# Altium project spider-nest.PrjPcb
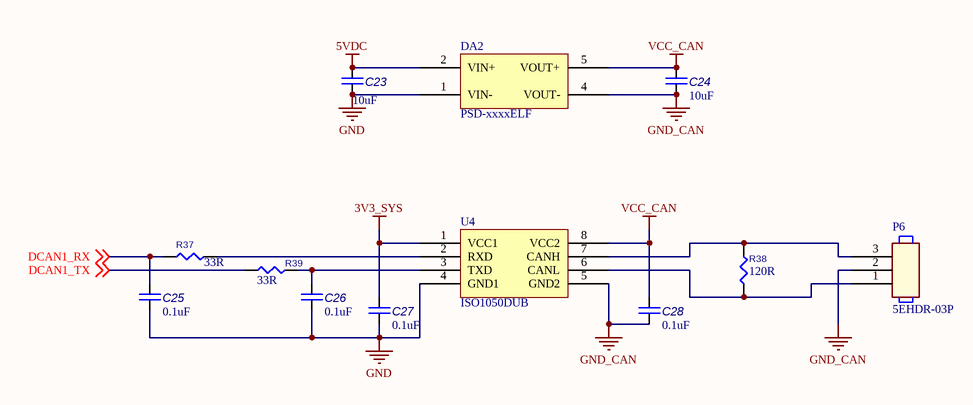
[diagram p0: can.SchDoc]
12 sheets, 181 parts. Net scope: flat (ports and power ports of the same name join across sheets).
Board file: spider-nest.PcbDoc
Sheets:
  can.SchDoc
  wifi.SchDoc
  audio.SchDoc
  spider-som.SchDoc
  eth_usb.SchDoc
  power.SchDoc
  rs485.SchDoc
  digital-in.SchDoc
  relay.SchDoc
  1-wire.SchDoc
  boot.SchDoc
  expansion_gpio.SchDoc

## Sheet can.SchDoc
size A4

### Parts
C23  value 10uF  [CC2012-0805]  (hidden comment: C0805)
C24  value 10uF  [CC2012-0805]  (hidden comment: C0805)
C25  value 0.1uF  [CC1608-0603]  (hidden comment: C0603)
C26  value 0.1uF  [CC1608-0603]  (hidden comment: C0603)
C27  value 0.1uF  [CC1608-0603]  (hidden comment: C0603)
C28  value 0.1uF  [CC1608-0603]  (hidden comment: C0603)
DA2  PSD-xxxxELF  [PSD-xxxxELF]
P6  P/N: 5EHDR-03P  [TE_282814-3]  (hidden comment: TE_282814-3)
R37  value 33R  [RESC1608X55N]  (hidden comment: R0603)
R38  value 120R  [RESC1608X55N]  (hidden comment: R0603)
R39  value 33R  [RESC1608X55N]  (hidden comment: R0603)
U4  ISO1050DUB  [SO-G8/Z10.8]

### Nets
3V3_SYS: C27.1 U4.1(VCC1)
5VDC: C23.2 DA2.2(VIN+)
GND: C23.1 C25.2 C26.2 C27.2 DA2.1(VIN-) U4.4(GND1)
GND_CAN: C24.1 C28.2 DA2.4(VOUT-) P6.2 U4.5(GND2)
VCC_CAN: C24.2 C28.1 DA2.5(VOUT+) U4.8(VCC2)
DCAN1_RX: C25.1 R37.2 ; off-sheet DCAN1_RX
DCAN1_TX: R39.2 ; off-sheet DCAN1_TX
NetC26_1: C26.1 R39.1 U4.3(TXD)
NetP6_1: P6.1 R38.1 U4.6(CANL)
NetP6_3: P6.3 R38.2 U4.7(CANH)
NetR37_1: R37.1 U4.2(RXD)

### Library data of the parts
DA2 = PSD-xxxxELF: single output isolated DC/DC converter; Manufacturer: PEAK electronics; P/N: PSD-0505ELF
P6 = TE_282814-3: Terminal Block Connectors
U4 = ISO1050DUB: ISOLATED CAN TRANSCEIVER; Manufacturer: TI; P/N: ISO1050DUBR
C23 C24 = C0805: P/N: *
C25-C28 = C0603: P/N: *
R37-R39 = R0603: P/N: *

## Sheet wifi.SchDoc
size A4
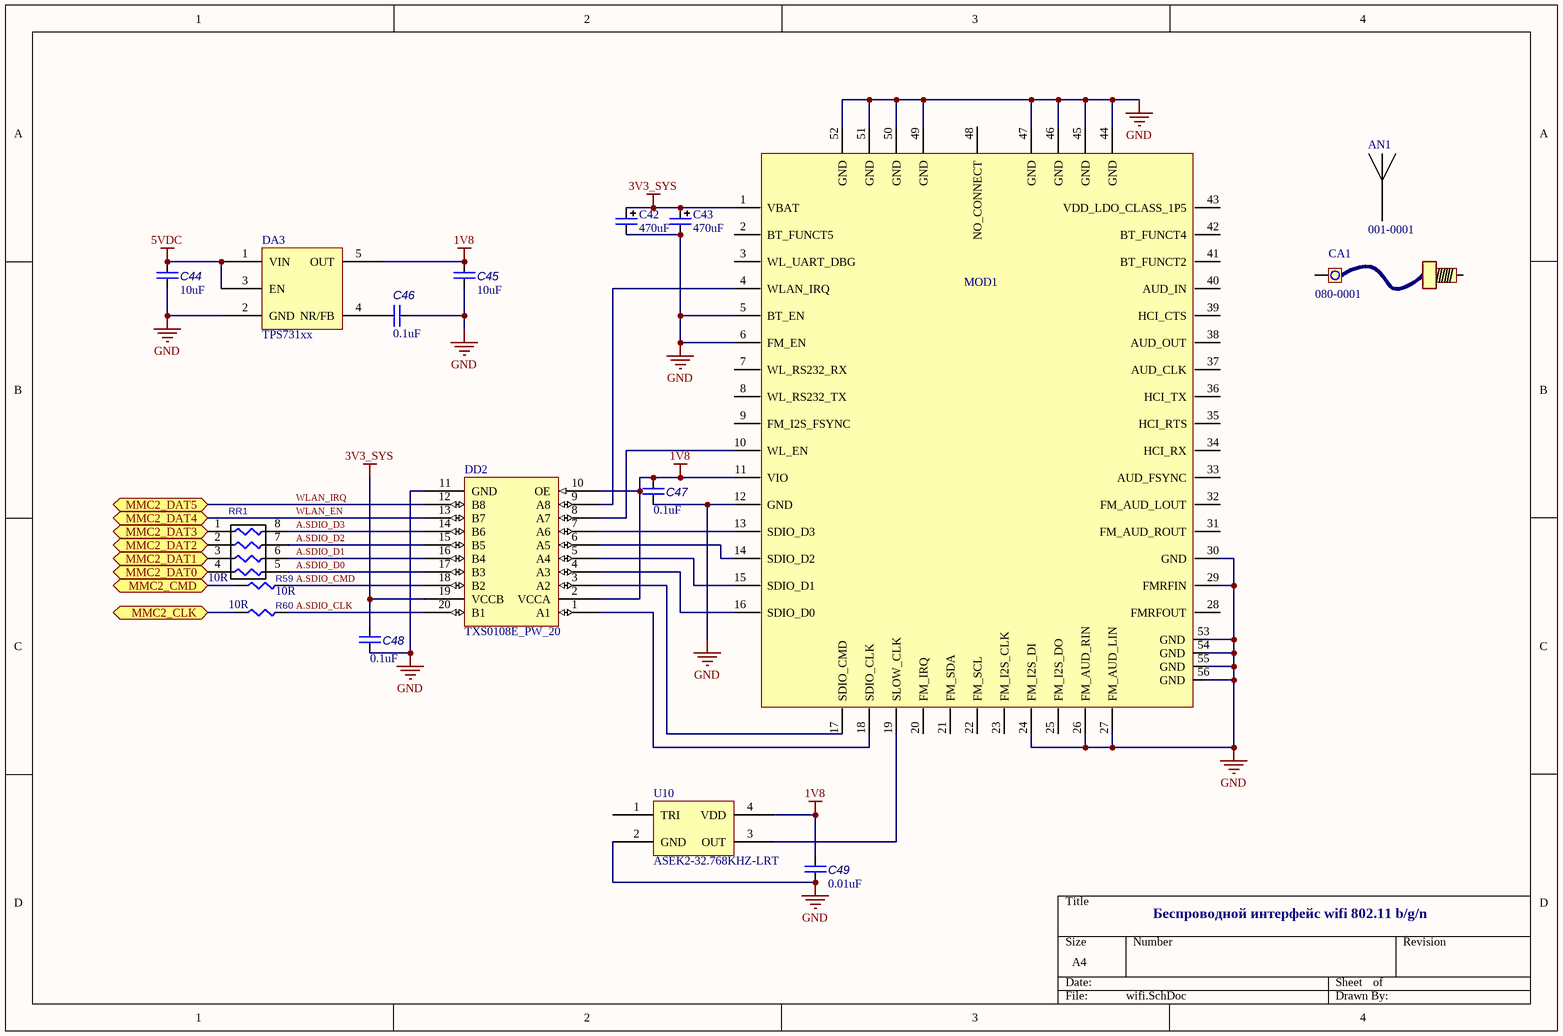
[diagram p1: wifi.SchDoc]

### Parts
AN1  P/N: 001-0001  (hidden comment: Antenna)
C42  value 470uF  [Cap_D]  (hidden comment: Cap_D)
C43  value 470uF  [Cap_D]  (hidden comment: Cap_D)
C44  value 10uF  [CC2012-0805]  (hidden comment: C0805)
C45  value 10uF  [CC2012-0805]  (hidden comment: C0805)
C46  value 0.1uF  [CC1608-0603]  (hidden comment: C0603)
C47  value 0.1uF  [CC1608-0603]  (hidden comment: C0603)
C48  value 0.1uF  [CC1608-0603]  (hidden comment: C0603)
C49  value 0.01uF  [CC1608-0603]  (hidden comment: C0603)
CA1  P/N: 080-0001  (hidden comment: Cable)
DA3  TPS731xx  [SOT95P280X145-5N]
DD2  TXS0108E_PW_20  [PW20]
MOD1  TIWI-R2_MODULE_UFL  [tiwi-r2]  (value not drawn)
R59  value 10R  [RESC1608X55N]  (hidden comment: R0603)
R60  value 10R  [RESC1608X55N]  (hidden comment: R0603)
RR1  value 10R  [CAY16-J4]  (hidden comment: CAY-J4)
U10  ASEK2-32.768KHZ-LRT  [asek1]

### Ports
MMC2_CLK, MMC2_CMD, MMC2_DAT0, MMC2_DAT1, MMC2_DAT2, MMC2_DAT3, MMC2_DAT4, MMC2_DAT5

### Nets
1V8: C45.2 C47.2 C49.1 DA3.5(OUT) DD2.2(VCCA) DD2.10(OE) MOD1.11(VIO) U10.4(VDD)
3V3_SYS: C42.1 C43.1 C48.2 DD2.19(VCCB) MOD1.1(VBAT)
5VDC: C44.2 DA3.1(VIN) DA3.3(EN)
GND: C42.2 C43.2 C44.1 C45.1 C46.1 C47.1 C48.1 C49.2 DA3.2(GND) DD2.11(GND) MOD1.5(BT_EN) MOD1.6(FM_EN) MOD1.12(GND) MOD1.24(FM_I2S_DI) MOD1.26(FM_AUD_RIN) MOD1.27(FM_AUD_LIN) MOD1.29(FMRFIN) MOD1.30(GND) MOD1.44(GND) MOD1.45(GND) MOD1.46(GND) MOD1.47(GND) MOD1.49(GND) MOD1.50(GND) MOD1.51(GND) MOD1.52(GND) MOD1.53(GND) MOD1.54(GND) MOD1.55(GND) MOD1.56(GND) U10.2(GND)
A.SDIO_CLK: DD2.20(B1) R60.2
A.SDIO_CMD: DD2.18(B2) R59.2
A.SDIO_D0: DD2.17(B3) RR1.5
A.SDIO_D1: DD2.16(B4) RR1.6
A.SDIO_D2: DD2.15(B5) RR1.7
A.SDIO_D3: DD2.14(B6) RR1.8
WLAN_EN: DD2.13(B7) ; port MMC2_DAT4
WLAN_IRQ: DD2.12(B8) ; port MMC2_DAT5
NetC46_2: C46.2 DA3.4(NR/FB)
NetDD2_1: DD2.1(A1) MOD1.18(SDIO_CLK)
NetDD2_3: DD2.3(A2) MOD1.17(SDIO_CMD)
NetDD2_4: DD2.4(A3) MOD1.16(SDIO_D0)
NetDD2_5: DD2.5(A4) MOD1.15(SDIO_D1)
NetDD2_6: DD2.6(A5) MOD1.14(SDIO_D2)
NetDD2_7: DD2.7(A6) MOD1.13(SDIO_D3)
NetDD2_8: DD2.8(A7) MOD1.10(WL_EN)
NetDD2_9: DD2.9(A8) MOD1.4(WLAN_IRQ)
NetMOD1_19: MOD1.19(SLOW_CLK) U10.3(OUT)
NetR59_1: R59.1 ; port MMC2_CMD
NetR60_1: R60.1 ; port MMC2_CLK
NetRR1_1: RR1.1 ; port MMC2_DAT3
NetRR1_2: RR1.2 ; port MMC2_DAT2
NetRR1_3: RR1.3 ; port MMC2_DAT1
NetRR1_4: RR1.4 ; port MMC2_DAT0

Not connected (* = marked no-connect by the designer): AN1 1; CA1 1 2; MOD1 2(BT_FUNCT5) 3(WL_UART_DBG) 7(WL_RS232_RX) 8(WL_RS232_TX) 9(FM_I2S_FSYNC) 20(FM_IRQ) 21(FM_SDA) 22(FM_SCL) 23(FM_I2S_CLK) 25(FM_I2S_DO) 28(FMRFOUT) 31(FM_AUD_ROUT) 32(FM_AUD_LOUT) 33(AUD_FSYNC) 34(HCI_RX) 35(HCI_RTS) 36(HCI_TX) 37(AUD_CLK) 38(AUD_OUT) 39(HCI_CTS) 40(AUD_IN) 41(BT_FUNCT2) 42(BT_FUNCT4) 43(VDD_LDO_CLASS_1P5) 48(NO_CONNECT); U10 1(TRI)

### Notes on the sheet
- Беспроводной интерфейс wifi 802.11 b/g/n

### Library data of the parts
C42 C43 = Cap_D: Tantalum Capacitor Case D; P/N: TR3D477M6R3C0200
CA1 = Cable: Wifi Cable
DA3 = TPS731xx: Cap-Free, NMOS, 150mA LDO; Manufacturer: TI; P/N: TPS73118DBVT
DD2 = TXS0108E_PW_20: Imported; Vendor: Texas Instruments; P/N: TXS0108EPWR; PACKAGE_DESIGNATOR: PW; PIN_COUNT: 20; FAMILY_NAME: AUTO DIRECTION SENSING DUAL SUPPLY TRANSLATOR; INDUSTRY_STD_PKG_TYPE: TSSOP; Manufacturer_Part_Number: txs0108e_pw_20; Datasheet URL: http://www.ti.com/lit/gpn/TXS0108E; Manufacturer: Texas Instruments; RefDes: RefDes; Type: DEV; Value: Value
MOD1 = TIWI-R2_MODULE_UFL: TiWi-R2 with u.fl Module; MANUFACTURER: LSR; Geometry.Height: 1.9mm; P/N: 450-0037; PCB DECAL: TIWI-R2_UFL
RR1 = CAY-J4: Resistor network 4x
U10 = ASEK2-32.768KHZ-LRT: 32.768KHZ 1.8V oscillator; Manufacturer: Abracon; P/N: ASEK2-32.768KHZ-LRT
C44 C45 = C0805: P/N: *
C46-C49 = C0603: P/N: *
R59 R60 = R0603: P/N: *

## Sheet audio.SchDoc
size A4
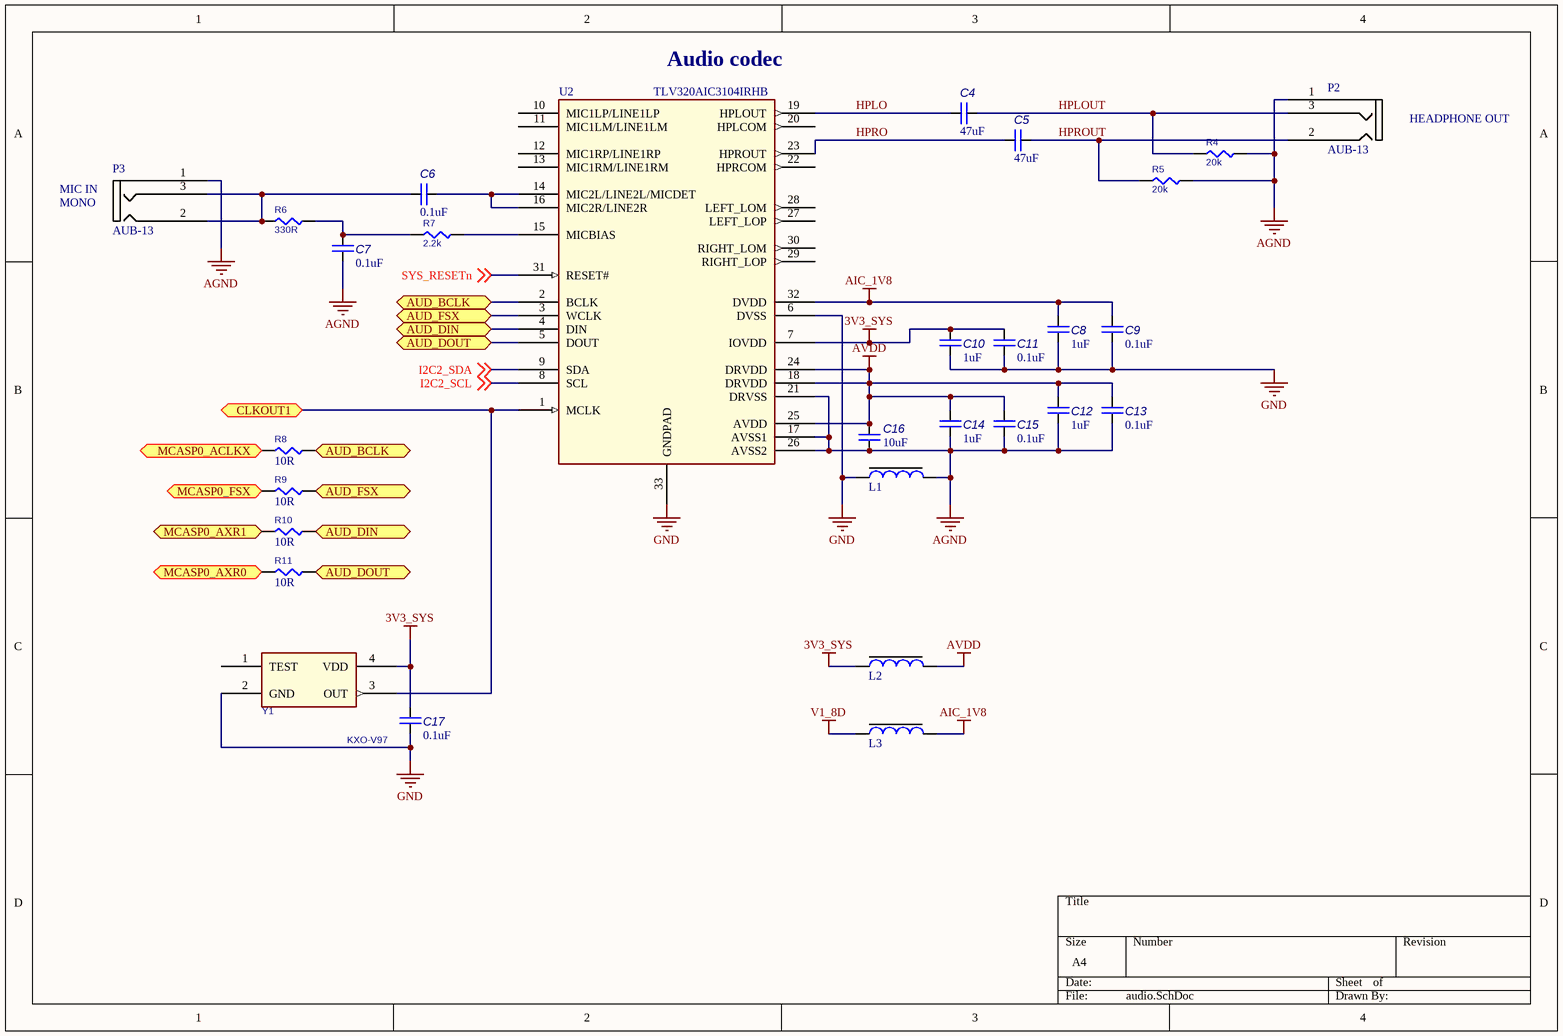
[diagram p2: audio.SchDoc]

### Parts
C4  value 47uF  [CC3216-1206]  (hidden comment: C1206)
C5  value 47uF  [CC3216-1206]  (hidden comment: C1206)
C6  value 0.1uF  [CC1608-0603]  (hidden comment: C0603)
C7  value 0.1uF  [CC1608-0603]  (hidden comment: C0603)
C8  value 1uF  [CC1608-0603]  (hidden comment: C0603)
C9  value 0.1uF  [CC1608-0603]  (hidden comment: C0603)
C10  value 1uF  [CC1608-0603]  (hidden comment: C0603)
C11  value 0.1uF  [CC1608-0603]  (hidden comment: C0603)
C12  value 1uF  [CC1608-0603]  (hidden comment: C0603)
C13  value 0.1uF  [CC1608-0603]  (hidden comment: C0603)
C14  value 1uF  [CC1608-0603]  (hidden comment: C0603)
C15  value 0.1uF  [CC1608-0603]  (hidden comment: C0603)
C16  value 10uF  [CC2012-0805]  (hidden comment: C0805)
C17  value 0.1uF  [CC1608-0603]  (hidden comment: C0603)
L1  BLM21  [CC2012-0805]  (value not drawn)
L2  BLM21  [CC2012-0805]  (value not drawn)
L3  BLM21  [CC2012-0805]  (value not drawn)
P2  AUB-13  [AUB_13]
P3  AUB-13  [AUB_13]
R4  value 20k  [CHIP0603]  (hidden comment: R0603)
R5  value 20k  [CHIP0603]  (hidden comment: R0603)
R6  value 330R  [CHIP0603]  (hidden comment: R0603)
R7  value 2.2k  [CHIP0603]  (hidden comment: R0603)
R8  value 10R  [RESC1608X55N]  (hidden comment: R0603)
R9  value 10R  [RESC1608X55N]  (hidden comment: R0603)
R10  value 10R  [RESC1608X55N]  (hidden comment: R0603)
R11  value 10R  [RESC1608X55N]  (hidden comment: R0603)
U2  Man P/N: TLV320AIC3104IRHB  [QFN5X5-32]  (hidden comment: TLV320AIC3104)
Y1  KXO-V97  [KXO_V97]

### Ports
AUD_BCLK, AUD_DIN, AUD_DOUT, AUD_FSX, CLKOUT1, MCASP0_ACLKX, MCASP0_AXR0, MCASP0_AXR1, MCASP0_FSX

### Nets
3V3_SYS: C10.1 C11.1 C17.1 L2.1 U2.7(IOVDD) Y1.4(VDD)
AGND: C7.1 C12.2 C13.2 C14.2 C15.2 C16.1 L1.2 P2.1(GND) P3.1(GND) R4.1 R5.1 U2.17(AVSS1) U2.21(DRVSS) U2.26(AVSS2)
AIC_1V8: C8.1 C9.1 L3.2 U2.32(DVDD)
AVDD: C12.1 C13.1 C14.1 C15.1 C16.2 L2.2 U2.18(DRVDD) U2.24(DRVDD) U2.25(AVDD)
GND: C8.2 C9.2 C10.2 C11.2 C17.2 L1.1 U2.6(DVSS) U2.33(GNDPAD) Y1.2(GND)
V1_8D: L3.1
HPLO: C4.2 U2.19(HPLOUT)
HPLOUT: C4.1 P2.3(LEFT) R4.2
HPRO: C5.2 U2.23(HPROUT)
HPROUT: C5.1 P2.2(RIGHT) R5.2
I2C2_SCL: U2.8(SCL) ; off-sheet I2C2_SCL
I2C2_SDA: U2.9(SDA) ; off-sheet I2C2_SDA
SYS_RESETn: U2.31(RESET#) ; off-sheet SYS_RESETn
NetC6_1: C6.1 P3.2(RIGHT) P3.3(LEFT) R6.1
NetC6_2: C6.2 U2.14(MIC2L/LINE2L/MICDET) U2.16(MIC2R/LINE2R)
NetC7_2: C7.2 R6.2 R7.1
NetR7_2: R7.2 U2.15(MICBIAS)
NetR8_1: R8.1 ; port MCASP0_ACLKX
NetR8_2: R8.2 U2.2(BCLK) ; port AUD_BCLK
NetR9_1: R9.1 ; port MCASP0_FSX
NetR9_2: R9.2 U2.3(WCLK) ; port AUD_FSX
NetR10_1: R10.1 ; port MCASP0_AXR1
NetR10_2: R10.2 U2.4(DIN) ; port AUD_DIN
NetR11_1: R11.1 ; port MCASP0_AXR0
NetR11_2: R11.2 U2.5(DOUT) ; port AUD_DOUT
NetR61_1: U2.1(MCLK) Y1.3(OUT) ; port CLKOUT1

Not connected (* = marked no-connect by the designer): U2 10(MIC1LP/LINE1LP) 11(MIC1LM/LINE1LM) 12(MIC1RP/LINE1RP) 13(MIC1RM/LINE1RM) 20(HPLCOM) 22(HPRCOM) 27(LEFT_LOP) 28(LEFT_LOM) 29(RIGHT_LOP) 30(RIGHT_LOM); Y1 1(TEST)

### Notes on the sheet
- (near U2) Audio codec
- HEADPHONE OUT
- MIC IN
  MONO

### Library data of the parts
L1-L3 = BLM21: Ferrite bead; Manufacturer: Murata; P/N: BLM21AG601SN1D; Package: 0805
P2 P3 = AUB-13: Audio connector mini-jack 3.5mm, 3 pins; Vendor: brownbear.ru
R4-R7 = R0603: Resistor 0603
U2 = TLV320AIC3104: LOW-POWER STEREO AUDIO CODEC FOR PORTABLE AUDIO/TELEPHONY; Manufacturer: TI
Y1 = KXO-V97: Quartz oscillator 7x5mm; Manufacturer: Geyer; Value: 12MHz; Man P/N: KXO-V97
C4 C5 = C1206: P/N: *
C6-C15 C17 = C0603: P/N: *
C16 = C0805: P/N: *
R8-R11 = R0603: P/N: *

## Sheet spider-som.SchDoc
size A3
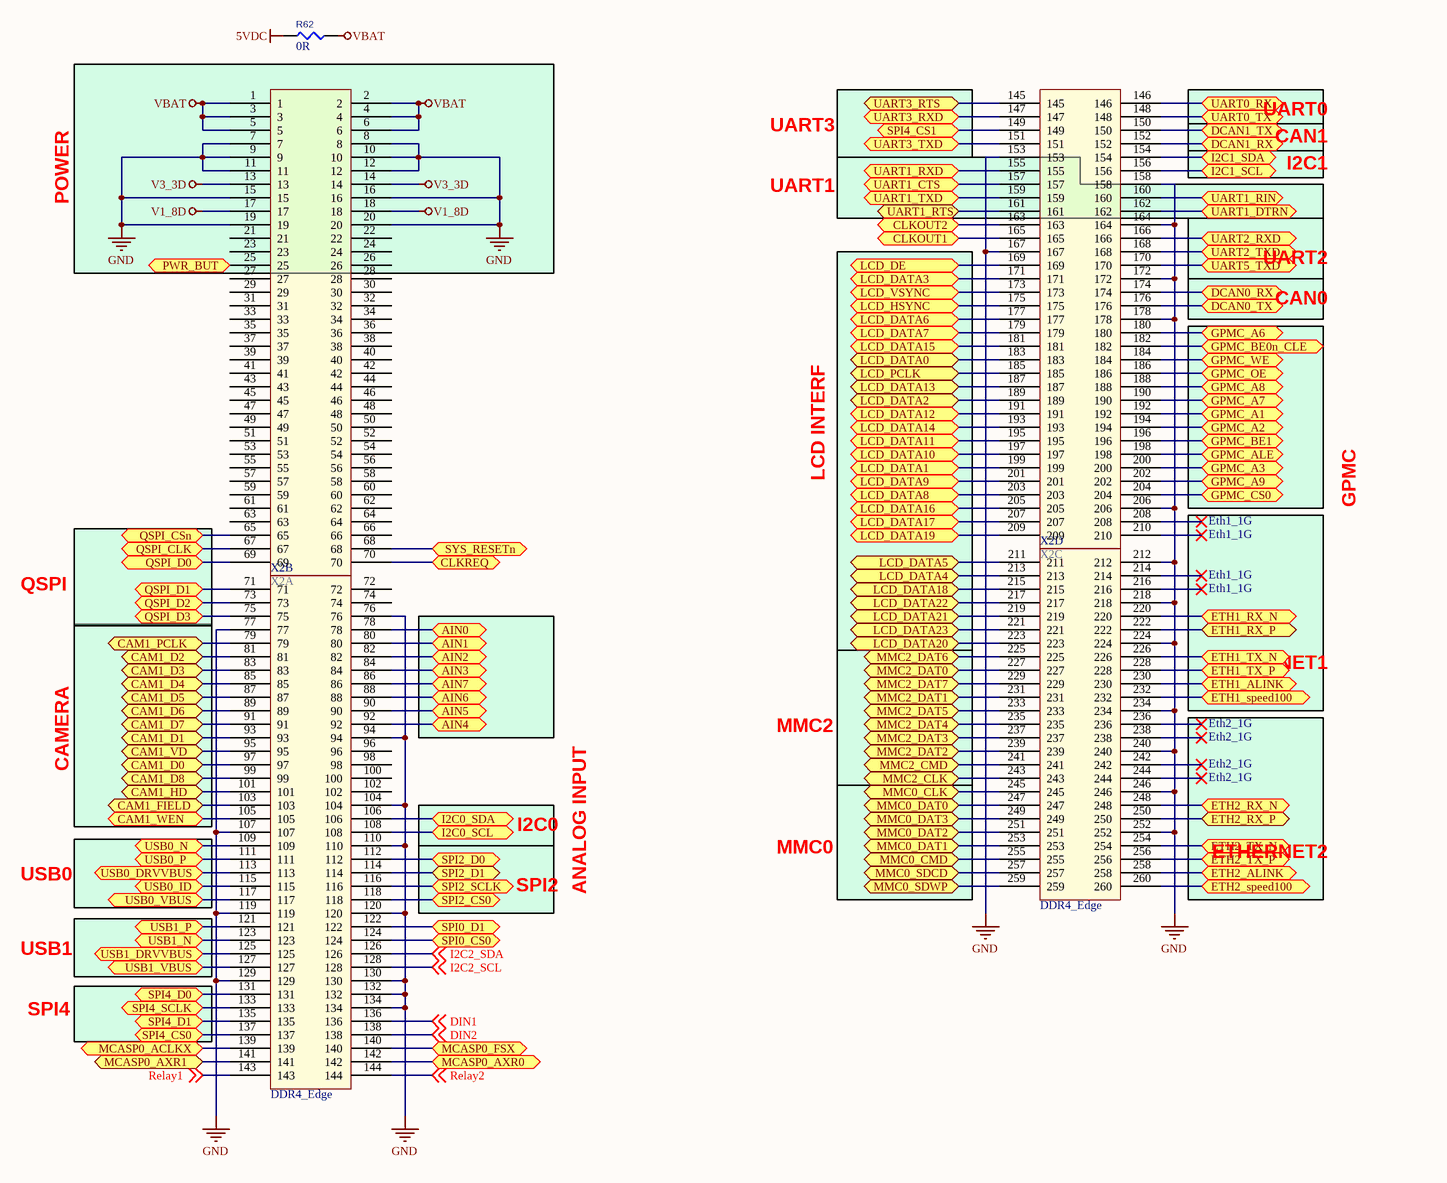
[diagram p3: spider-som.SchDoc]

### Parts
R62  value 0R  [RESC1608X55N]  (hidden comment: R0603)
X2  DDR4_Edge  [DDR4 SO_DIMM connector]  (value not drawn)  (parts A,B,C,D of 4)

### Ports
AIN0, AIN1, AIN2, AIN3, AIN4, AIN5, AIN6, AIN7, CAM1_D0, CAM1_D1, CAM1_D2, CAM1_D3, CAM1_D4, CAM1_D5, CAM1_D6, CAM1_D7, CAM1_D8, CAM1_FIELD, CAM1_HD, CAM1_PCLK, CAM1_VD, CAM1_WEN, CLKOUT1, CLKOUT2, CLKREQ, DCAN0_RX, DCAN0_TX, DCAN1_RX, DCAN1_TX, ETH1_ALINK, ETH1_RX_N, ETH1_RX_P, ETH1_speed100, ETH1_TX_N, ETH1_TX_P, ETH2_ALINK, ETH2_RX_N, ETH2_RX_P, ETH2_speed100, ETH2_TX_N, ETH2_TX_P, GPMC_A1, GPMC_A2, GPMC_A3, GPMC_A6, GPMC_A7, GPMC_A8, GPMC_A9, GPMC_ALE, GPMC_BE0n_CLE, GPMC_BE1, GPMC_CS0, GPMC_OE, GPMC_WE, I2C0_SCL, I2C0_SDA, I2C1_SCL, I2C1_SDA, LCD_DATA0, LCD_DATA1, LCD_DATA2, LCD_DATA3, LCD_DATA4, LCD_DATA5, LCD_DATA6, LCD_DATA7, LCD_DATA8, LCD_DATA9, LCD_DATA10, LCD_DATA11, LCD_DATA12, LCD_DATA13, LCD_DATA14, LCD_DATA15, LCD_DATA16, LCD_DATA17, LCD_DATA18, LCD_DATA19, LCD_DATA20, LCD_DATA21, LCD_DATA22, LCD_DATA23, LCD_DE, LCD_HSYNC, LCD_PCLK, LCD_VSYNC, MCASP0_ACLKX, MCASP0_AXR0, MCASP0_AXR1, MCASP0_FSX, MMC0_CLK, MMC0_CMD, MMC0_DAT0, MMC0_DAT1, MMC0_DAT2, MMC0_DAT3, MMC0_SDCD, MMC0_SDWP, MMC2_CLK, MMC2_CMD, MMC2_DAT0, MMC2_DAT1, MMC2_DAT2, MMC2_DAT3, MMC2_DAT4, MMC2_DAT5, MMC2_DAT6, MMC2_DAT7, PWR_BUT, QSPI_CLK, QSPI_CSn, QSPI_D0, QSPI_D1, QSPI_D2, QSPI_D3, SPI0_CS0, SPI0_D1, SPI2_CS0, SPI2_D0, SPI2_D1, SPI2_SCLK, SPI4_CS0, SPI4_CS1, SPI4_D0, SPI4_D1, SPI4_SCLK, SYS_RESETn, UART0_RX, UART0_TX, UART1_CTS, UART1_DTRN, UART1_RIN, UART1_RTS, UART1_RXD, UART1_TXD, UART2_RXD, UART2_TXD, UART3_RTS, UART3_RXD, UART3_TXD, UART5_TXD, USB0_DRVVBUS, USB0_ID, USB0_N, USB0_P, USB0_VBUS, USB1_DRVVBUS, USB1_N, USB1_P, USB1_VBUS

### Nets
5VDC: R62.1
GND: X2.7 X2.8 X2.9 X2.10 X2.11 X2.12 X2.15 X2.16 X2.19 X2.20 X2.76 X2.77 X2.94 X2.104 X2.107 X2.110 X2.119 X2.120 X2.129 X2.130 X2.132 X2.134 X2.153 X2.158 X2.164 X2.167 X2.172 X2.178 X2.206 X2.212 X2.218 X2.224 X2.234 X2.240 X2.246 X2.252
V1_8D: X2.17 X2.18
V3_3D: X2.13 X2.14
VBAT: R62.2 X2.1 X2.2 X2.3 X2.4 X2.5 X2.6
DIN1: X2.136 ; off-sheet DIN1
DIN2: X2.138 ; off-sheet DIN2
I2C2_SCL: X2.128 ; off-sheet I2C2_SCL
I2C2_SDA: X2.126 ; off-sheet I2C2_SDA
Relay1: X2.143 ; off-sheet Relay1
Relay2: X2.144 ; off-sheet Relay2
TXDEN0: X2.161 ; port UART1_RTS
WLAN_EN: X2.235 ; port MMC2_DAT4
WLAN_IRQ: X2.233 ; port MMC2_DAT5
NetR8_1: X2.139 ; port MCASP0_ACLKX
NetR9_1: X2.140 ; port MCASP0_FSX
NetR10_1: X2.141 ; port MCASP0_AXR1
NetR11_1: X2.142 ; port MCASP0_AXR0
NetR59_1: X2.241 ; port MMC2_CMD
NetR60_1: X2.243 ; port MMC2_CLK
NetR61_1: X2.165 ; port CLKOUT1
NetRR1_1: X2.237 ; port MMC2_DAT3
NetRR1_2: X2.239 ; port MMC2_DAT2
NetRR1_3: X2.231 ; port MMC2_DAT1
NetRR1_4: X2.227 ; port MMC2_DAT0
NetU8_1: X2.155 ; port UART1_RXD
NetU8_4: X2.159 ; port UART1_TXD
NetU9_1: X2.147 ; port UART3_RXD
NetU9_2: X2.145 ; port UART3_RTS
NetU9_4: X2.151 ; port UART3_TXD
NetX2_25: X2.25 ; port PWR_BUT
NetX2_65: X2.65 ; port QSPI_CSn
NetX2_67: X2.67 ; port QSPI_CLK
NetX2_68: X2.68 ; port SYS_RESETn
NetX2_69: X2.69 ; port QSPI_D0
NetX2_70: X2.70 ; port CLKREQ
NetX2_71: X2.71 ; port QSPI_D1
NetX2_73: X2.73 ; port QSPI_D2
NetX2_75: X2.75 ; port QSPI_D3
NetX2_78: X2.78 ; port AIN0
NetX2_79: X2.79 ; port CAM1_PCLK
NetX2_80: X2.80 ; port AIN1
NetX2_81: X2.81 ; port CAM1_D2
NetX2_82: X2.82 ; port AIN2
NetX2_83: X2.83 ; port CAM1_D3
NetX2_84: X2.84 ; port AIN3
NetX2_85: X2.85 ; port CAM1_D4
NetX2_86: X2.86 ; port AIN7
NetX2_87: X2.87 ; port CAM1_D5
NetX2_88: X2.88 ; port AIN6
NetX2_89: X2.89 ; port CAM1_D6
NetX2_90: X2.90 ; port AIN5
NetX2_91: X2.91 ; port CAM1_D7
NetX2_92: X2.92 ; port AIN4
NetX2_93: X2.93 ; port CAM1_D1
NetX2_95: X2.95 ; port CAM1_VD
NetX2_97: X2.97 ; port CAM1_D0
NetX2_99: X2.99 ; port CAM1_D8
NetX2_101: X2.101 ; port CAM1_HD
NetX2_103: X2.103 ; port CAM1_FIELD
NetX2_105: X2.105 ; port CAM1_WEN
NetX2_106: X2.106 ; port I2C0_SDA
NetX2_108: X2.108 ; port I2C0_SCL
NetX2_109: X2.109 ; port USB0_N
NetX2_111: X2.111 ; port USB0_P
NetX2_112: X2.112 ; port SPI2_D0
NetX2_113: X2.113 ; port USB0_DRVVBUS
NetX2_114: X2.114 ; port SPI2_D1
NetX2_115: X2.115 ; port USB0_ID
NetX2_116: X2.116 ; port SPI2_SCLK
NetX2_117: X2.117 ; port USB0_VBUS
NetX2_118: X2.118 ; port SPI2_CS0
NetX2_121: X2.121 ; port USB1_P
NetX2_122: X2.122 ; port SPI0_D1
NetX2_123: X2.123 ; port USB1_N
NetX2_124: X2.124 ; port SPI0_CS0
NetX2_125: X2.125 ; port USB1_DRVVBUS
NetX2_127: X2.127 ; port USB1_VBUS
NetX2_131: X2.131 ; port SPI4_D0
NetX2_133: X2.133 ; port SPI4_SCLK
NetX2_135: X2.135 ; port SPI4_D1
NetX2_137: X2.137 ; port SPI4_CS0
NetX2_146: X2.146 ; port UART0_RX
NetX2_148: X2.148 ; port UART0_TX
NetX2_149: X2.149 ; port SPI4_CS1
NetX2_150: X2.150 ; port DCAN1_TX
NetX2_152: X2.152 ; port DCAN1_RX
NetX2_154: X2.154 ; port I2C1_SDA
NetX2_156: X2.156 ; port I2C1_SCL
NetX2_157: X2.157 ; port UART1_CTS
NetX2_160: X2.160 ; port UART1_RIN
NetX2_162: X2.162 ; port UART1_DTRN
NetX2_163: X2.163 ; port CLKOUT2
NetX2_166: X2.166 ; port UART2_RXD
NetX2_168: X2.168 ; port UART2_TXD
NetX2_169: X2.169 ; port LCD_DE
NetX2_170: X2.170 ; port UART5_TXD
NetX2_171: X2.171 ; port LCD_DATA3
NetX2_173: X2.173 ; port LCD_VSYNC
NetX2_174: X2.174 ; port DCAN0_RX
NetX2_175: X2.175 ; port LCD_HSYNC
NetX2_176: X2.176 ; port DCAN0_TX
NetX2_177: X2.177 ; port LCD_DATA6
NetX2_179: X2.179 ; port LCD_DATA7
NetX2_180: X2.180 ; port GPMC_A6
NetX2_181: X2.181 ; port LCD_DATA15
NetX2_182: X2.182 ; port GPMC_BE0n_CLE
NetX2_183: X2.183 ; port LCD_DATA0
NetX2_184: X2.184 ; port GPMC_WE
NetX2_185: X2.185 ; port LCD_PCLK
NetX2_186: X2.186 ; port GPMC_OE
NetX2_187: X2.187 ; port LCD_DATA13
NetX2_188: X2.188 ; port GPMC_A8
NetX2_189: X2.189 ; port LCD_DATA2
NetX2_190: X2.190 ; port GPMC_A7
NetX2_191: X2.191 ; port LCD_DATA12
NetX2_192: X2.192 ; port GPMC_A1
NetX2_193: X2.193 ; port LCD_DATA14
NetX2_194: X2.194 ; port GPMC_A2
NetX2_195: X2.195 ; port LCD_DATA11
NetX2_196: X2.196 ; port GPMC_BE1
NetX2_197: X2.197 ; port LCD_DATA10
NetX2_198: X2.198 ; port GPMC_ALE
NetX2_199: X2.199 ; port LCD_DATA1
NetX2_200: X2.200 ; port GPMC_A3
NetX2_201: X2.201 ; port LCD_DATA9
NetX2_202: X2.202 ; port GPMC_A9
NetX2_203: X2.203 ; port LCD_DATA8
NetX2_204: X2.204 ; port GPMC_CS0
NetX2_205: X2.205 ; port LCD_DATA16
NetX2_207: X2.207 ; port LCD_DATA17
NetX2_209: X2.209 ; port LCD_DATA19
NetX2_211: X2.211 ; port LCD_DATA5
NetX2_213: X2.213 ; port LCD_DATA4
NetX2_215: X2.215 ; port LCD_DATA18
NetX2_217: X2.217 ; port LCD_DATA22
NetX2_219: X2.219 ; port LCD_DATA21
NetX2_220: X2.220 ; port ETH1_RX_N
NetX2_221: X2.221 ; port LCD_DATA23
NetX2_222: X2.222 ; port ETH1_RX_P
NetX2_223: X2.223 ; port LCD_DATA20
NetX2_225: X2.225 ; port MMC2_DAT6
NetX2_226: X2.226 ; port ETH1_TX_N
NetX2_228: X2.228 ; port ETH1_TX_P
NetX2_229: X2.229 ; port MMC2_DAT7
NetX2_230: X2.230 ; port ETH1_ALINK
NetX2_232: X2.232 ; port ETH1_speed100
NetX2_245: X2.245 ; port MMC0_CLK
NetX2_247: X2.247 ; port MMC0_DAT0
NetX2_248: X2.248 ; port ETH2_RX_N
NetX2_249: X2.249 ; port MMC0_DAT3
NetX2_250: X2.250 ; port ETH2_RX_P
NetX2_251: X2.251 ; port MMC0_DAT2
NetX2_253: X2.253 ; port MMC0_DAT1
NetX2_254: X2.254 ; port ETH2_TX_N
NetX2_255: X2.255 ; port MMC0_CMD
NetX2_256: X2.256 ; port ETH2_TX_P
NetX2_257: X2.257 ; port MMC0_SDCD
NetX2_258: X2.258 ; port ETH2_ALINK
NetX2_259: X2.259 ; port MMC0_SDWP
NetX2_260: X2.260 ; port ETH2_speed100

Not connected (* = marked no-connect by the designer): X2 21 22 23 24 26 27 28 29 30 31 32 33 34 35 36 37 38 39 40 41 42 43 44 45 46 47 48 49 50 51 52 53 54 55 56 57 58 59 60 61 62 63 64 66 72 74 96 98 100 102 208* 210* 214* 216* 236* 238* 242* 244*

### Notes on the sheet
- UART0
- CAN1
- POWER
- UART3
- UART1
- I2C1
- UART2
- CAN0
- GPMC
- LCD INTERF
- Eth1_1G
- QSPI
- ETHERNET1
- ANALOG INPUT
- MMC2
- Eth2_1G
- CAMERA
- I2C0
- SPI2
- MMC0
- ETHERNET2
- USB0
- USB1
- SPI4

### Library data of the parts
X2 = DDR4_Edge: DDR4 edge memory SO-DIMM connector, 260 pin; P/N: 2309407-1
R62 = R0603: P/N: *

## Sheet eth_usb.SchDoc
size A3
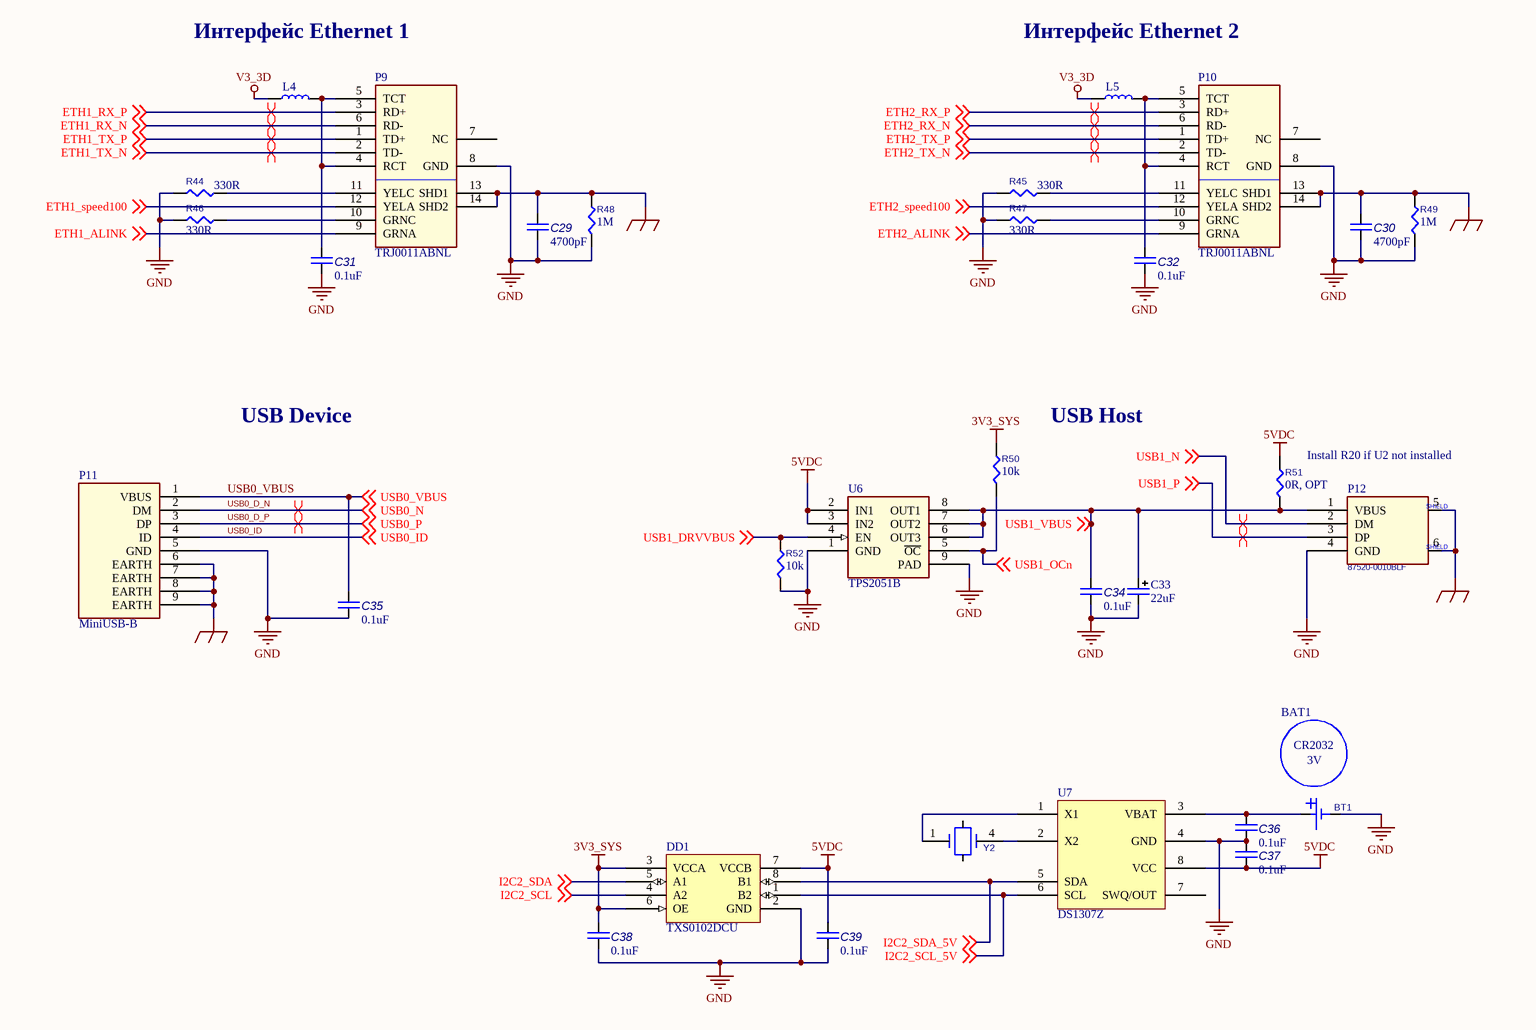
[diagram p4: eth_usb.SchDoc]

### Parts
BAT1  CR2032-BAT  (value not drawn)
BT1  CR2032  [BH2032CH25]  (value not drawn)
C29  value 4700pF  [CC1608-0603]  (hidden comment: C0603)
C30  value 4700pF  [CC1608-0603]  (hidden comment: C0603)
C31  value 0.1uF  [CC1608-0603]  (hidden comment: C0603)
C32  value 0.1uF  [CC1608-0603]  (hidden comment: C0603)
C33  value 22uF  [CAP_B]  (hidden comment: *)
C34  value 0.1uF  [CC1608-0603]  (hidden comment: C0603)
C35  value 0.1uF  [CC1608-0603]  (hidden comment: C0603)
C36  value 0.1uF  [CC1608-0603]  (hidden comment: C0603)
C37  value 0.1uF  [CC1608-0603]  (hidden comment: C0603)
C38  value 0.1uF  [CC1608-0603]  (hidden comment: C0603)
C39  value 0.1uF  [CC1608-0603]  (hidden comment: C0603)
DD1  TXS0102DCU  [SOP127P600-8N]
L4  BLM18A-FB  [CHIP0603]  (value not drawn)
L5  BLM18A-FB  [CHIP0603]  (value not drawn)
P9  CONN_RJ45_MAG_WE_0  [TRJ0011ABNL]  (value not drawn)
P10  CONN_RJ45_MAG_WE_0  [TRJ0011ABNL]  (value not drawn)
P11  MiniUSB-B  [MINI-USB-B5 SMT]
P12  P/N: 87520-0010BLF  [USB2.5-2H4C]  (hidden comment: CONN_54819-0578_2)
R44  value 330R  [RESC1608X55N]  (hidden comment: R0603)
R45  value 330R  [RESC1608X55N]  (hidden comment: R0603)
R46  value 330R  [RESC1608X55N]  (hidden comment: R0603)
R47  value 330R  [RESC1608X55N]  (hidden comment: R0603)
R48  value 1M  [RESC1608X55N]  (hidden comment: R0603)
R49  value 1M  [RESC1608X55N]  (hidden comment: R0603)
R50  value 10k  [RESC1608X55N]  (hidden comment: R0603)
R51  value 0R, OPT  [RESC1608X55N]  (hidden comment: R0603)
R52  value 10k  [RESC1608X55N]  (hidden comment: R0603)
U6  TPS2051B  [R-PDSO-G8]
U7  DS1307Z  [SOIC127P600X175-8N]
Y2  KX-327S  [ABS25-32.768KHZ-T]  (value not drawn)

### Nets
3V3_SYS: C38.1 DD1.3(VCCA) DD1.6(OE) R50.2
5VDC: C37.2 C39.1 DD1.7(VCCB) R51.2 U6.2(IN1) U6.3(IN2) U7.8(VCC)
EARTH: C29.1 C30.1 P9.13(SHD1) P9.14(SHD2) P10.13(SHD1) P10.14(SHD2) P11.6(EARTH) P11.7(EARTH) P11.8(EARTH) P11.9(EARTH) P12.5(SHELD1) P12.6(PAD4) R48.2 R49.2
GND: BT1.2 C29.2 C30.2 C31.2 C32.2 C33.2 C34.1 C35.2 C36.2 C37.1 C38.2 C39.2 DD1.2(GND) P9.8(GND) P10.8(GND) P11.5(GND) P12.4(GND) R44.1 R45.1 R46.1 R47.1 R48.1 R49.1 R52.1 U6.1(GND) U6.9(PAD) U7.4(GND)
V3_3D: L4.1 L5.1
ETH1_ALINK: P9.9(GRNA) ; off-sheet ETH1_ALINK
ETH1_RX_N: P9.6(RD-) ; off-sheet ETH1_RX_N
ETH1_RX_P: P9.3(RD+) ; off-sheet ETH1_RX_P
ETH1_speed100: P9.12(YELA) ; off-sheet ETH1_speed100
ETH1_TX_N: P9.2(TD-) ; off-sheet ETH1_TX_N
ETH1_TX_P: P9.1(TD+) ; off-sheet ETH1_TX_P
ETH2_ALINK: P10.9(GRNA) ; off-sheet ETH2_ALINK
ETH2_RX_N: P10.6(RD-) ; off-sheet ETH2_RX_N
ETH2_RX_P: P10.3(RD+) ; off-sheet ETH2_RX_P
ETH2_speed100: P10.12(YELA) ; off-sheet ETH2_speed100
ETH2_TX_N: P10.2(TD-) ; off-sheet ETH2_TX_N
ETH2_TX_P: P10.1(TD+) ; off-sheet ETH2_TX_P
I2C2_SCL: DD1.4(A2) ; off-sheet I2C2_SCL
I2C2_SCL_5V: DD1.1(B2) U7.6(SCL) ; off-sheet I2C2_SCL_5V
I2C2_SDA: DD1.5(A1) ; off-sheet I2C2_SDA
I2C2_SDA_5V: DD1.8(B1) U7.5(SDA) ; off-sheet I2C2_SDA_5V
USB0_D_N: P11.2(DM) ; off-sheet USB0_N  [also labelled USB0_N]
USB0_D_P: P11.3(DP) ; off-sheet USB0_P  [also labelled USB0_P]
USB0_ID: P11.4(ID) ; off-sheet USB0_ID
USB0_VBUS: C35.1 P11.1(VBUS) ; off-sheet USB0_VBUS
USB1_DRVVBUS: R52.2 U6.4(EN) ; off-sheet USB1_DRVVBUS
USB1_N: P12.2(DM) ; off-sheet USB1_N
USB1_OCn: R50.1 U6.5(~{OC}) ; off-sheet USB1_OCn
USB1_P: P12.3(DP) ; off-sheet USB1_P
USB1_VBUS: C33.1 C34.2 P12.1(VBUS) R51.1 U6.6(OUT3) U6.7(OUT2) U6.8(OUT1) ; off-sheet USB1_VBUS
NetBT1_1: BT1.1 C36.1 U7.3(VBAT)
NetC31_1: C31.1 L4.2 P9.4(RCT) P9.5(TCT)
NetC32_1: C32.1 L5.2 P10.4(RCT) P10.5(TCT)
NetP9_10: P9.10(GRNC) R46.2
NetP9_11: P9.11(YELC) R44.2
NetP10_10: P10.10(GRNC) R47.2
NetP10_11: P10.11(YELC) R45.2
NetU7_1: U7.1(X1) Y2.1
NetU7_2: U7.2(X2) Y2.4

Not connected (* = marked no-connect by the designer): P9 7(NC); P10 7(NC); U7 7(SWQ/OUT); Y2 2 3

### Layout directives
differential pair: ETH1_RX_N, ETH1_RX_P, ETH1_TX_N, ETH1_TX_P, ETH2_RX_N, ETH2_RX_P, ETH2_TX_N, ETH2_TX_P, USB0_D_N, USB0_D_P, USB1_N, USB1_P

### Notes on the sheet
- Интерфейс Ethernet 1
- Интерфейс Ethernet 2
- USB Device
- USB Host
- (near R51) Install R20 if U2 not installed
- (in symbol CONN_54819-0578_2) SHIELD
- (in symbol CR2032-BAT) 3V

### Library data of the parts
BAT1 = CR2032-BAT: Battery CR2032; P/N: CR2032
BT1 = CR2032: CR2032 battery holder; P/N: CH25-2032
C33 = Cap_B: Tantalum Capacitor Case D; P/N: *
DD1 = TXS0102DCU: 2bit Bidirectional voltage translator; Manufacturer: TI; Package: DCU; P/N: TXS0102DCU
L4 L5 = BLM18A-FB: Chip EMIFILr Inductor Type; Manufacturer: Murata; P/N: BLM18AG601SN1D
P9 P10 = CONN_RJ45_MAG_WE_0: RJ-45 10/100 W/Magnetics; Mfr: Link PP; P/N-2: Wurth 7499011212; P/N: TRJ0011ABNL
P11 = MiniUSB-B: Mini USB Type B CONNECTOR; Mfr: Hirose; P/N: UX60SC-MB-5ST(80)
P12 = CONN_54819-0578_2: USB Type A Connectors; Mfr: FCI
U6 = TPS2051B: CURRENT-LIMITED, POWER-DISTRIBUTION SWITCHES; Mfr: TI; P/N: TPS2051BDGN
U7 = DS1307Z: I2C Real-Time Clock; Manufacturer: Maxim/Dallas; P/N: DS1307ZN+T&R
Y2 = KX-327S: CRYSTAL 32.768KHZ 12.5PF SMD; Mfr: Abracon; P/N: ABS25-32.768KHZ-T
C29-C32 C34-C39 = C0603: P/N: *
R44-R52 = R0603: P/N: *

## Sheet power.SchDoc
size A4
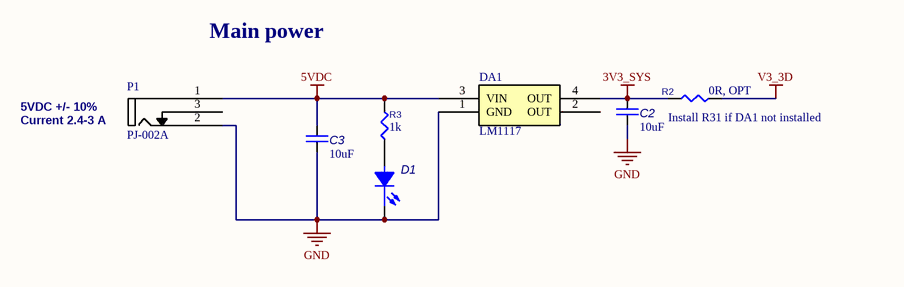
[diagram p5: power.SchDoc]

### Parts
C2  value 10uF  [CC2012-0805]  (hidden comment: C0805)
C3  value 10uF  [CC2012-0805]  (hidden comment: C0805)
D1  LED0805  [LED0805]  (value not drawn)
DA1  LM1117  [SOT230P700X160-4N]
P1  PJ-002A  [PJ-002A]
R2  value 0R, OPT  [RESC1608X55N]  (hidden comment: R0603)
R3  value 1k  [RESC1608X55N]  (hidden comment: R0603)

### Nets
3V3_SYS: C2.2 DA1.4(OUT) R2.1
5VDC: C3.2 DA1.3(VIN) P1.1(GND) R3.2
GND: C2.1 C3.1 D1.K(C) DA1.1(GND) P1.2(RIGHT)
V3_3D: R2.2
NetD1_A: D1.A R3.1

Not connected (* = marked no-connect by the designer): DA1 2(OUT); P1 3(LEFT)

### Notes on the sheet
- Main power
- 5VDC +/- 10%
  Current 2.4-3 A
- (near R2) Install R31 if DA1 not installed

### Library data of the parts
D1 = LED0805: LED 0805; Value: *
DA1 = LM1117: 800mA Low-Dropout Linear Regulator; Manufacturer: National; Man P/N: LM1117IMPX-3.3, OPT; Package: 3-lead  SOT-223
P1 = PJ-002A: DC POWER JACK; Manufacturer: CIU Inc; Vendor: Digi-key; Alternative P/N: DJK-02A; Man P/N: PJ-002A
C2 C3 = C0805: P/N: *
R2 R3 = R0603: P/N: *

## Sheet rs485.SchDoc
size A4
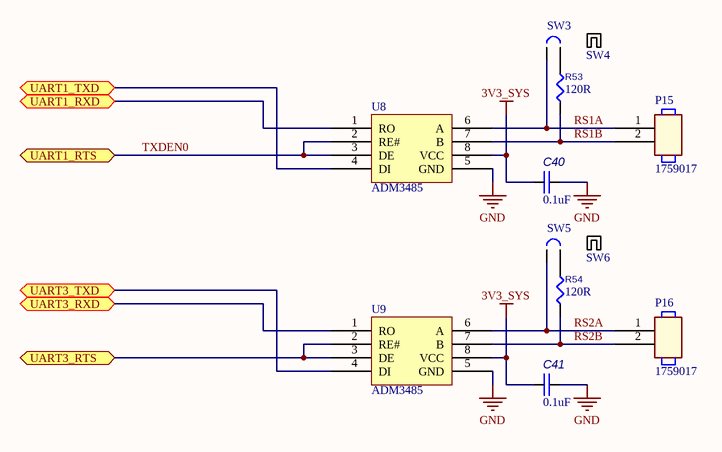
[diagram p6: rs485.SchDoc]

### Parts
C40  value 0.1uF  [CC1608-0603]  (hidden comment: C0603)
C41  value 0.1uF  [CC1608-0603]  (hidden comment: C0603)
P15  P/N2: 1759017  [TE_282814-2]  (hidden comment: TE_282814-2)
P16  P/N2: 1759017  [TE_282814-2]  (hidden comment: TE_282814-2)
R53  value 120R  [RESC1608X55N]  (hidden comment: R0603)
R54  value 120R  [RESC1608X55N]  (hidden comment: R0603)
SW3  Jumper 2-pin  [JUMPER_2]  (value not drawn)
SW4  Jumper  (value not drawn)
SW5  Jumper 2-pin  [JUMPER_2]  (value not drawn)
SW6  Jumper  (value not drawn)
U8  ADM3485  [SOIC127P600X175-8N]
U9  ADM3485  [SOIC127P600X175-8N]

### Ports
UART1_RTS, UART1_RXD, UART1_TXD, UART3_RTS, UART3_RXD, UART3_TXD

### Nets
3V3_SYS: C40.1 C41.1 U8.8(VCC) U9.8(VCC)
GND: C40.2 C41.2 U8.5(GND) U9.5(GND)
RS1A: P15.1 SW3.1 U8.6(A)
RS1B: P15.2 R53.1 U8.7(B)
RS2A: P16.1 SW5.1 U9.6(A)
RS2B: P16.2 R54.1 U9.7(B)
TXDEN0: U8.2(RE#) U8.3(DE) ; port UART1_RTS
NetR53_2: R53.2 SW3.2
NetR54_2: R54.2 SW5.2
NetU8_1: U8.1(RO) ; port UART1_RXD
NetU8_4: U8.4(DI) ; port UART1_TXD
NetU9_1: U9.1(RO) ; port UART3_RXD
NetU9_2: U9.2(RE#) U9.3(DE) ; port UART3_RTS
NetU9_4: U9.4(DI) ; port UART3_TXD

Not connected (* = marked no-connect by the designer): SW4 1 2; SW6 1 2

### Library data of the parts
P15 P16 = TE_282814-2: Terminal Block Connectors; Manufacturer: TE Connectivity; P/N: 282814-2
SW3 SW5 = Jumper 2-pin: Jumper 2-pin 2.54mm; P/N: PLS-2
SW4 SW6 = Jumper: Jumper 2.54mm; P/N: MJ-0
U8 U9 = ADM3485: RS-485 Half-Duplex transceiver; P/N2: ADM3485ARZ; P/N: SN65HVD1780DR
C40 C41 = C0603: P/N: *
R53 R54 = R0603: P/N: *

## Sheet digital-in.SchDoc
size A4
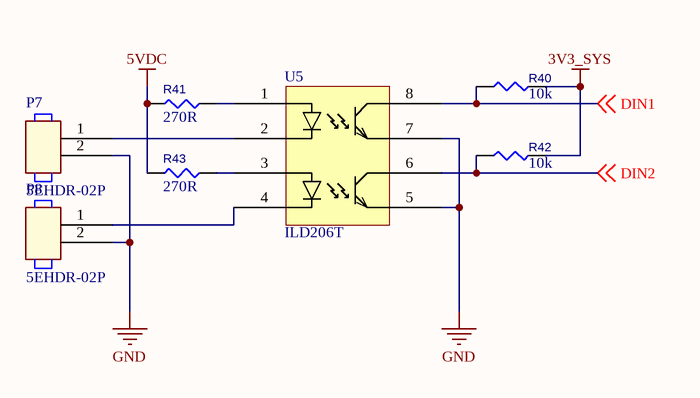
[diagram p7: digital-in.SchDoc]

### Parts
P7  P/N: 5EHDR-02P  [TE_282814-2]  (hidden comment: TE_282814-2)
P8  P/N: 5EHDR-02P  [TE_282814-2]  (hidden comment: TE_282814-2)
R40  value 10k  [RESC1608X55N]  (hidden comment: R0603)
R41  value 270R  [RESC1608X55N]  (hidden comment: R0603)
R42  value 10k  [RESC1608X55N]  (hidden comment: R0603)
R43  value 270R  [RESC1608X55N]  (hidden comment: R0603)
U5  ILD206T  [SOIC-8-OPTOCOUPLER]

### Nets
3V3_SYS: R40.2 R42.2
5VDC: R41.1 R43.1
GND: P7.2 P8.2 U5.5(TE1) U5.7(TE1)
DIN1: R40.1 U5.8(TC1) ; off-sheet DIN1
DIN2: R42.1 U5.6(TC2) ; off-sheet DIN2
NetP7_1: P7.1 U5.2(C1)
NetP8_1: P8.1 U5.4(C2)
NetR41_2: R41.2 U5.1(A1)
NetR43_2: R43.2 U5.3(A2)

### Library data of the parts
P7 P8 = TE_282814-2: as P15 on sheet rs485
U5 = ILD206T: Optocoupler, Phototransistor Output, Dual Channel; Manufacturer: *; P/N: ILD206T
R40-R43 = R0603: P/N: *

## Sheet relay.SchDoc
size A4
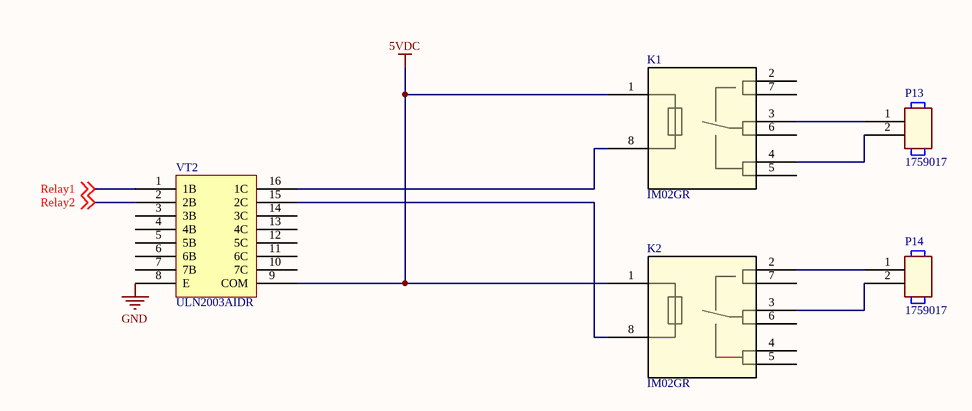
[diagram p8: relay.SchDoc]

### Parts
K1  IM02GR  [IM-Gull]
K2  IM02GR  [IM-Gull]
P13  P/N2: 1759017  [TE_282814-2]  (hidden comment: TE_282814-2)
P14  P/N2: 1759017  [TE_282814-2]  (hidden comment: TE_282814-2)
VT2  P/N: ULN2003AIDR  [SO-G16]  (hidden comment: ULN2003A)

### Nets
5VDC: K1.1(C+) K2.1(C+) VT2.9(COM)
GND: VT2.8(E)
Relay1: VT2.1(1B) ; off-sheet Relay1
Relay2: VT2.2(2B) ; off-sheet Relay2
NetK1_3: K1.3(S1) P13.1
NetK1_4: K1.4(A1) P13.2
NetK1_8: K1.8(C-) VT2.16(1C)
NetK2_2: K2.2(I1) P14.1
NetK2_3: K2.3(S1) P14.2
NetK2_8: K2.8(C-) VT2.15(2C)

Not connected (* = marked no-connect by the designer): K1 2(I1) 5(A2) 6(S2) 7(I2); K2 4(A1) 5(A2) 6(S2) 7(I2); VT2 3(3B) 4(4B) 5(5B) 6(6B) 7(7B) 10(7C) 11(6C) 12(5C) 13(4C) 14(3C)

### Library data of the parts
K1 K2 = IM02GR: Signal Relay; Coil Voltage VDC Nom:4.5V; P/N: IM02GR
P13 P14 = TE_282814-2: as P15 on sheet rs485; P/N: 282814-2
VT2 = ULN2003A: DARLINGTON TRANSISTOR ARRAYS; Manufacturer: TI

## Sheet 1-wire.SchDoc
size A4
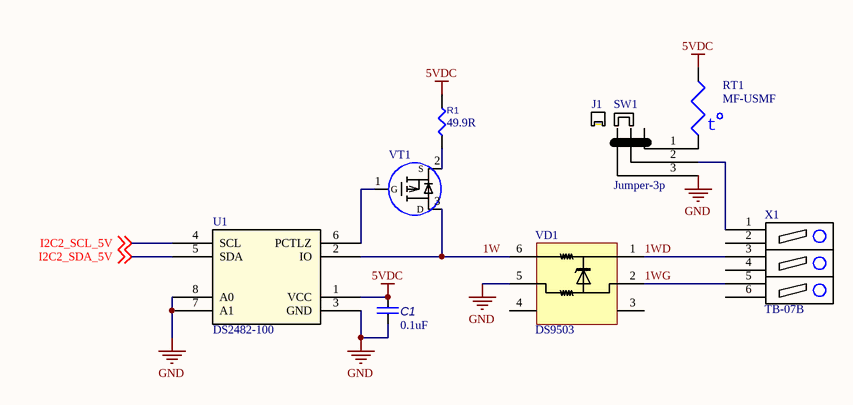
[diagram p9: 1-wire.SchDoc]

### Parts
C1  value 0.1uF  [CC1608-0603]  (hidden comment: C0603)
J1  Jumper-cap  (value not drawn)
R1  value 49.9R  [RESC1608X55N]  (hidden comment: R0603)
RT1  MF-USMF  [MF-USMF]
SW1  Jumper-3p  [pls-3]
U1  DS2482-100  [SOIC127P600X175-8N]
VD1  DS9503  [tsoc6]
VT1  P-FET SOT-23  [SO-G3]  (value not drawn)
X1  TB-07B  [TB-07B]

### Nets
5VDC: C1.1 R1.2 RT1.1 U1.1(VCC)
GND: C1.2 SW1.3 U1.3(GND) U1.7(A1) U1.8(A0) VD1.5
1W: U1.2(IO) VD1.6 VT1.3(D)
1WD: VD1.1 X1.3
1WG: VD1.2 X1.5
I2C2_SCL_5V: U1.4(SCL) ; off-sheet I2C2_SCL_5V
I2C2_SDA_5V: U1.5(SDA) ; off-sheet I2C2_SDA_5V
NetR1_1: R1.1 VT1.2(S)
NetRT1_2: RT1.2 SW1.1
NetSW1_2: SW1.2 X1.1
NetU1_6: U1.6(PCTLZ) VT1.1(G)

Not connected (* = marked no-connect by the designer): VD1 3 4; X1 2 4 6

### Notes on the sheet
- (in symbol MF-USMF) t

### Library data of the parts
J1 = Jumper-cap: Jumper; P/N: MJ-0
RT1 = MF-USMF: PTC Resettable Fuses; Manufacturer: Bourns; P/N: MF-USMF050
SW1 = Jumper-3p: PLS-3 2.54mm pin connector; P/N: PLS-3
U1 = DS2482-100: I2C - 1-Wire master single channel; P/N: DS2482S-100+
VD1 = DS9503: ESD Protection Diode with Resistors; P/N: DS9503P+
VT1 = P-FET SOT-23: P-FET transistor in SOT-23-3 package; P/N: IRLML6402PbF
X1 = TB-07B: Terminal Block 3 pos; P/N: TB-07B
C1 = C0603: P/N: *
R1 = R0603: P/N: *

## Sheet boot.SchDoc
size A4
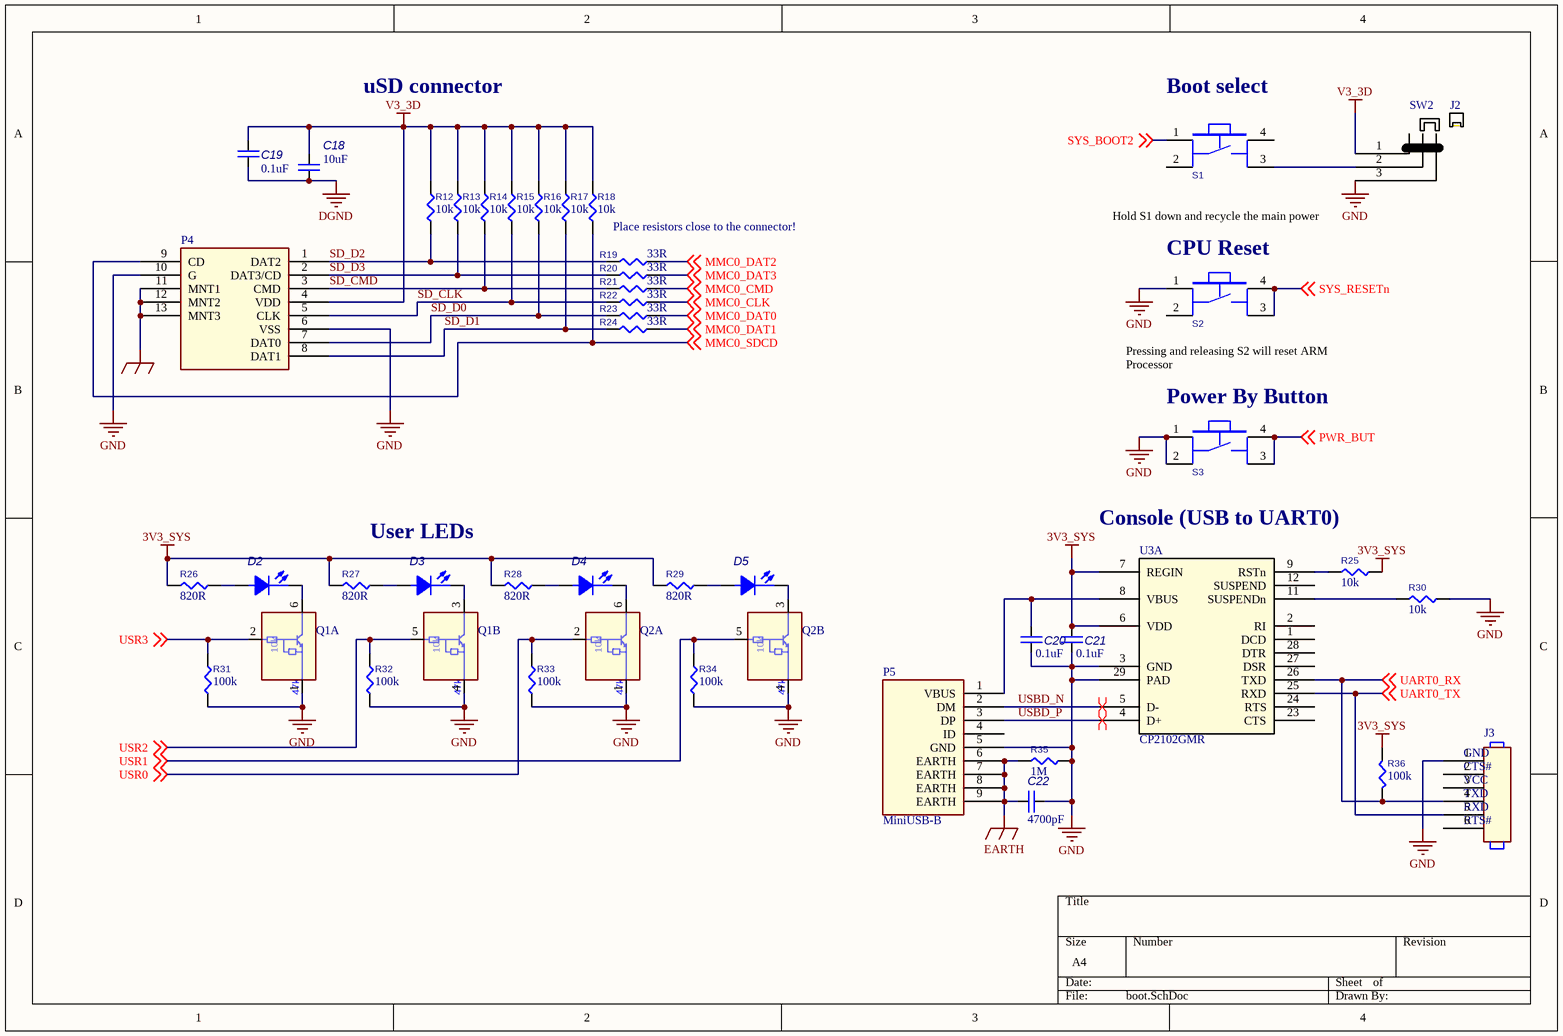
[diagram p10: boot.SchDoc]

### Parts
C18  value 10uF  [CC2012-0805]  (hidden comment: C0805)
C19  value 0.1uF  [CC1608-0603]  (hidden comment: C0603)
C20  value 0.1uF  [CC1608-0603]  (hidden comment: C0603)
C21  value 0.1uF  [CC1608-0603]  (hidden comment: C0603)
C22  value 4700pF  [CC1608-0603]  (hidden comment: C0603)
D2  LED0805  [LED0805]  (value not drawn)
D3  LED0805  [LED0805]  (value not drawn)
D4  LED0805  [LED0805]  (value not drawn)
D5  LED0805  [LED0805]  (value not drawn)
J2  Jumper-cap  (value not drawn)
J3  HEADER 6  [pls-6]  (value not drawn)
P4  (no value)  [TFC08WP01F-A-R1K-H]
P5  MiniUSB-B  [MINI-USB-B5 SMT]
Q1  RN1907  [SOT363-6L]  (value not drawn)  (parts A,B of 2)
Q2  RN1907  [SOT363-6L]  (value not drawn)  (parts A,B of 2)
R12  value 10k  [RESC1608X55N]  (hidden comment: R0603)
R13  value 10k  [RESC1608X55N]  (hidden comment: R0603)
R14  value 10k  [RESC1608X55N]  (hidden comment: R0603)
R15  value 10k  [RESC1608X55N]  (hidden comment: R0603)
R16  value 10k  [RESC1608X55N]  (hidden comment: R0603)
R17  value 10k  [RESC1608X55N]  (hidden comment: R0603)
R18  value 10k  [RESC1608X55N]  (hidden comment: R0603)
R19  value 33R  [RESC1608X55N]  (hidden comment: R0603)
R20  value 33R  [RESC1608X55N]  (hidden comment: R0603)
R21  value 33R  [RESC1608X55N]  (hidden comment: R0603)
R22  value 33R  [RESC1608X55N]  (hidden comment: R0603)
R23  value 33R  [RESC1608X55N]  (hidden comment: R0603)
R24  value 33R  [RESC1608X55N]  (hidden comment: R0603)
R25  value 10k  [RESC1608X55N]  (hidden comment: R0603)
R26  value 820R  [RESC1608X55N]  (hidden comment: R0603)
R27  value 820R  [RESC1608X55N]  (hidden comment: R0603)
R28  value 820R  [RESC1608X55N]  (hidden comment: R0603)
R29  value 820R  [RESC1608X55N]  (hidden comment: R0603)
R30  value 10k  [RESC1608X55N]  (hidden comment: R0603)
R31  value 100k  [RESC1608X55N]  (hidden comment: R0603)
R32  value 100k  [RESC1608X55N]  (hidden comment: R0603)
R33  value 100k  [RESC1608X55N]  (hidden comment: R0603)
R34  value 100k  [RESC1608X55N]  (hidden comment: R0603)
R35  value 1M  [RESC1608X55N]  (hidden comment: R0603)
R36  value 100k  [RESC1608X55N]  (hidden comment: R0603)
S1  *  [SWT-32]  (value not drawn)
S2  *  [SWT-32]  (value not drawn)
S3  *  [SWT-32]  (value not drawn)
SW2  Jumper-3p  [pls-3]  (value not drawn)
U3  CP2102GMR  [Qfn28-0.5]  (part A of 2)

### Nets
3V3_SYS: C21.1 R25.2 R26.2 R27.2 R28.2 R29.2 R36.2 U3.6(VDD) U3.7(REGIN)
DGND: C18.1 C19.2
EARTH: C22.1 P4.11(MNT1) P4.12(MNT2) P4.13(MNT3) P5.6(EARTH) P5.7(EARTH) P5.8(EARTH) P5.9(EARTH) R35.1
GND: C20.2 C21.2 C22.2 J3.1 P4.6(VSS) P4.10(G) P5.5(GND) Q1.1 Q1.4 Q2.1 Q2.4 R30.2 R31.1 R32.1 R33.1 R34.1 R35.2 S2.1 S3.1 S3.2 SW2.3 U3.3(GND) U3.29(PAD)
V3_3D: C18.2 C19.1 P4.4(VDD) R12.2 R13.2 R14.2 R15.2 R16.2 R17.2 R18.2 SW2.1
MMC0_CLK: R22.2 ; off-sheet MMC0_CLK
MMC0_CMD: R21.2 ; off-sheet MMC0_CMD
MMC0_DAT0: R23.2 ; off-sheet MMC0_DAT0
MMC0_DAT1: R24.2 ; off-sheet MMC0_DAT1
MMC0_DAT2: R19.2 ; off-sheet MMC0_DAT2
MMC0_DAT3: R20.2 ; off-sheet MMC0_DAT3
MMC0_SDCD: P4.9(CD) R18.1 ; off-sheet MMC0_SDCD
PWR_BUT: S3.3 S3.4 ; off-sheet PWR_BUT
SD_CLK: P4.5(CLK) R15.1 R22.1
SD_CMD: P4.3(CMD) R14.1 R21.1
SD_D0: P4.7(DAT0) R16.1 R23.1
SD_D1: P4.8(DAT1) R17.1 R24.1
SD_D2: P4.1(DAT2) R12.1 R19.1
SD_D3: P4.2(DAT3/CD) R13.1 R20.1
SYS_BOOT2: S1.1 ; off-sheet SYS_BOOT2
SYS_RESETn: S2.3 S2.4 ; off-sheet SYS_RESETn
UART0_RX: J3.4 R36.1 U3.26(TXD) ; off-sheet UART0_RX
UART0_TX: J3.5 U3.25(RXD) ; off-sheet UART0_TX
USBD_N: P5.2(DM) U3.5(D-)
USBD_P: P5.3(DP) U3.4(D+)
USR0: Q2.2 R33.2 ; off-sheet USR0
USR1: Q2.5 R34.2 ; off-sheet USR1
USR2: Q1.5 R32.2 ; off-sheet USR2
USR3: Q1.2 R31.2 ; off-sheet USR3
NetC20_1: C20.1 P5.1(VBUS) U3.8(VBUS)
NetD2_A: D2.A R26.1
NetD2_K: D2.K(C) Q1.6
NetD3_A: D3.A R27.1
NetD3_K: D3.K(C) Q1.3
NetD4_A: D4.A R28.1
NetD4_K: D4.K(C) Q2.6
NetD5_A: D5.A R29.1
NetD5_K: D5.K(C) Q2.3
NetR25_1: R25.1 U3.9(RSTn)
NetR30_1: R30.1 U3.11(SUSPENDn)
NetS1_3: S1.3 SW2.2

Not connected (* = marked no-connect by the designer): J3 2 3 6; P5 4(ID); S1 2 4; S2 2; U3 1(DCD) 2(RI) 12(SUSPEND) 23(CTS) 24(RTS) 27(DSR) 28(DTR)

### Layout directives
differential pair: USBD_N, USBD_P

### Notes on the sheet
- uSD connector
- (near S1) Boot select
- Place resistors close to the connector!
- Hold S1 down and recycle the main power
- (near S2) CPU Reset
- (near S2) Pressing and releasing S2 will reset ARM Processor
- (near S3) Power By Button
- User LEDs
- Console (USB to UART0)
- (near J3) GND
- (near J3) CTS#
- (near J3) VCC
- (near J3) TXD
- (near J3) RXD
- (near J3) RTS#
- (in symbol RN1907, part A) 10k; 47k
- (in symbol RN1907, part B) 10k; 47k

### Library data of the parts
D2-D5 = LED0805: LED 0805; Value: *
J2 = Jumper-cap: Jumper; P/N: MJ-0
J3 = HEADER 6: CONN HEADER 6POS, VERTICAL,  .100 STR TIN; Mfr: FCI; P/N: 68000-406HLF
P4 = TFC08WP01F-R1K-H-CN: Connector for microSD™ Card (Push-push Type); Mfr: AUK Contractors Co, LTD; P/N: TFC08WP01F-R1K-H-CN
P5 = MiniUSB-B: as P11 on sheet eth_usb
Q1 Q2 = RN1907: Transistor Silicon NPN; Mfr: ONS; P/N: MUN5211DW1T1G
S1-S3 = SWT-32: Push button; Vendor: brownbear.ru; P/N: SWT-32
SW2 = Jumper-3p: PLS-3 2.54mm pin connector; P/N: PLS-3
U3 = CP2102GMR: USB UART convertor; P/N: CP2102-GMR
C18 = C0805: P/N: *
C19-C22 = C0603: P/N: *
R12-R36 = R0603: P/N: *

## Sheet expansion_gpio.SchDoc
size A4
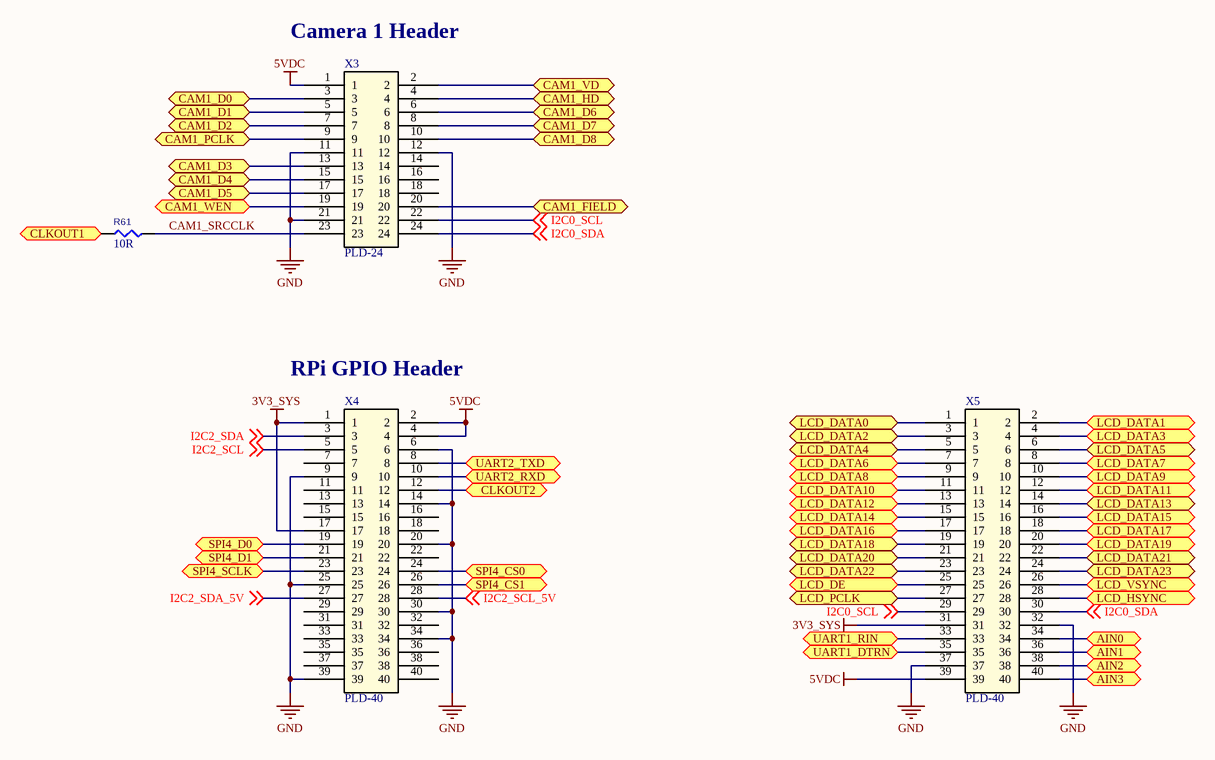
[diagram p11: expansion_gpio.SchDoc]

### Parts
R61  value 10R  [RESC1608X55N]  (hidden comment: R0603)
X3  PLD-24  [PLD-24]
X4  PLD-40  [PLD-40]
X5  PLD-40  [PLD-40]

### Ports
AIN0, AIN1, AIN2, AIN3, CAM1_D0, CAM1_D1, CAM1_D2, CAM1_D3, CAM1_D4, CAM1_D5, CAM1_D6, CAM1_D7, CAM1_D8, CAM1_FIELD, CAM1_HD, CAM1_PCLK, CAM1_VD, CAM1_WEN, CLKOUT1, CLKOUT2, LCD_DATA0, LCD_DATA1, LCD_DATA2, LCD_DATA3, LCD_DATA4, LCD_DATA5, LCD_DATA6, LCD_DATA7, LCD_DATA8, LCD_DATA9, LCD_DATA10, LCD_DATA11, LCD_DATA12, LCD_DATA13, LCD_DATA14, LCD_DATA15, LCD_DATA16, LCD_DATA17, LCD_DATA18, LCD_DATA19, LCD_DATA20, LCD_DATA21, LCD_DATA22, LCD_DATA23, LCD_DE, LCD_HSYNC, LCD_PCLK, LCD_VSYNC, SPI4_CS0, SPI4_CS1, SPI4_D0, SPI4_D1, SPI4_SCLK, UART1_DTRN, UART1_RIN, UART2_RXD, UART2_TXD

### Nets
3V3_SYS: X4.1 X4.17 X5.31
5VDC: X3.1 X4.2 X4.4 X5.39
GND: X3.11 X3.12 X3.21 X4.6 X4.9 X4.14 X4.20 X4.25 X4.30 X4.34 X4.39 X5.32 X5.37
CAM1_SRCCLK: R61.2 X3.23
I2C0_SCL: X3.22 X5.29 ; off-sheet I2C0_SCL
I2C0_SDA: X3.24 X5.30 ; off-sheet I2C0_SDA
I2C2_SCL: X4.5 ; off-sheet I2C2_SCL
I2C2_SCL_5V: X4.28 ; off-sheet I2C2_SCL_5V
I2C2_SDA: X4.3 ; off-sheet I2C2_SDA
I2C2_SDA_5V: X4.27 ; off-sheet I2C2_SDA_5V
NetR61_1: R61.1 ; port CLKOUT1
NetX2_78: X5.34 ; port AIN0
NetX2_79: X3.9 ; port CAM1_PCLK
NetX2_80: X5.36 ; port AIN1
NetX2_81: X3.7 ; port CAM1_D2
NetX2_82: X5.38 ; port AIN2
NetX2_83: X3.13 ; port CAM1_D3
NetX2_84: X5.40 ; port AIN3
NetX2_85: X3.15 ; port CAM1_D4
NetX2_87: X3.17 ; port CAM1_D5
NetX2_89: X3.6 ; port CAM1_D6
NetX2_91: X3.8 ; port CAM1_D7
NetX2_93: X3.5 ; port CAM1_D1
NetX2_95: X3.2 ; port CAM1_VD
NetX2_97: X3.3 ; port CAM1_D0
NetX2_99: X3.10 ; port CAM1_D8
NetX2_101: X3.4 ; port CAM1_HD
NetX2_103: X3.20 ; port CAM1_FIELD
NetX2_105: X3.19 ; port CAM1_WEN
NetX2_131: X4.19 ; port SPI4_D0
NetX2_133: X4.23 ; port SPI4_SCLK
NetX2_135: X4.21 ; port SPI4_D1
NetX2_137: X4.24 ; port SPI4_CS0
NetX2_149: X4.26 ; port SPI4_CS1
NetX2_160: X5.33 ; port UART1_RIN
NetX2_162: X5.35 ; port UART1_DTRN
NetX2_163: X4.12 ; port CLKOUT2
NetX2_166: X4.10 ; port UART2_RXD
NetX2_168: X4.8 ; port UART2_TXD
NetX2_169: X5.25 ; port LCD_DE
NetX2_171: X5.4 ; port LCD_DATA3
NetX2_173: X5.26 ; port LCD_VSYNC
NetX2_175: X5.28 ; port LCD_HSYNC
NetX2_177: X5.7 ; port LCD_DATA6
NetX2_179: X5.8 ; port LCD_DATA7
NetX2_181: X5.16 ; port LCD_DATA15
NetX2_183: X5.1 ; port LCD_DATA0
NetX2_185: X5.27 ; port LCD_PCLK
NetX2_187: X5.14 ; port LCD_DATA13
NetX2_189: X5.3 ; port LCD_DATA2
NetX2_191: X5.13 ; port LCD_DATA12
NetX2_193: X5.15 ; port LCD_DATA14
NetX2_195: X5.12 ; port LCD_DATA11
NetX2_197: X5.11 ; port LCD_DATA10
NetX2_199: X5.2 ; port LCD_DATA1
NetX2_201: X5.10 ; port LCD_DATA9
NetX2_203: X5.9 ; port LCD_DATA8
NetX2_205: X5.17 ; port LCD_DATA16
NetX2_207: X5.18 ; port LCD_DATA17
NetX2_209: X5.20 ; port LCD_DATA19
NetX2_211: X5.6 ; port LCD_DATA5
NetX2_213: X5.5 ; port LCD_DATA4
NetX2_215: X5.19 ; port LCD_DATA18
NetX2_217: X5.23 ; port LCD_DATA22
NetX2_219: X5.22 ; port LCD_DATA21
NetX2_221: X5.24 ; port LCD_DATA23
NetX2_223: X5.21 ; port LCD_DATA20

Not connected (* = marked no-connect by the designer): X3 14 16 18; X4 7 11 13 15 16 18 22 29 31 32 33 35 36 37 38 40

### Notes on the sheet
- (near X3) Camera 1 Header
- (near X4) RPi GPIO Header

### Library data of the parts
X3 = HDR12x2: P/N: PLD-24
X4 X5 = HDR20x2: P/N: PLD-40
R61 = R0603: P/N: *

## Nets that join several sheets
3V3_SYS: can (C27.1 U4.1), wifi (5 pins), audio (6 pins), eth_usb (C38.1 DD1.3 DD1.6 R50.2), power (C2.2 DA1.4 R2.1), rs485 (C40.1 C41.1 U8.8 U9.8), digital-in (R40.2 R42.2), boot (9 pins), expansion_gpio (X4.1 X4.17 X5.31)
5VDC: can (C23.2 DA2.2), wifi (C44.2 DA3.1 DA3.3), spider-som (R62.1), eth_usb (7 pins), power (C3.2 DA1.3 P1.1 R3.2), digital-in (R41.1 R43.1), relay (K1.1 K2.1 VT2.9), 1-wire (C1.1 R1.2 RT1.1 U1.1), expansion_gpio (X3.1 X4.2 X4.4 X5.39)
EARTH: eth_usb (14 pins), boot (9 pins)
GND: can (6 pins), wifi (31 pins), audio (9 pins), spider-som (36 pins), eth_usb (27 pins), power (5 pins), rs485 (C40.2 C41.2 U8.5 U9.5), digital-in (P7.2 P8.2 U5.5 U5.7), relay (VT2.8), 1-wire (6 pins), boot (23 pins), expansion_gpio (13 pins)
V1_8D: audio (L3.1), spider-som (X2.17 X2.18)
V3_3D: spider-som (X2.13 X2.14), eth_usb (L4.1 L5.1), power (R2.2), boot (11 pins)
DIN1: spider-som (X2.136), digital-in (R40.1 U5.8)
DIN2: spider-som (X2.138), digital-in (R42.1 U5.6)
I2C2_SCL: audio (U2.8), spider-som (X2.128), eth_usb (DD1.4), expansion_gpio (X4.5)
I2C2_SCL_5V: eth_usb (DD1.1 U7.6), 1-wire (U1.4), expansion_gpio (X4.28)
I2C2_SDA: audio (U2.9), spider-som (X2.126), eth_usb (DD1.5), expansion_gpio (X4.3)
I2C2_SDA_5V: eth_usb (DD1.8 U7.5), 1-wire (U1.5), expansion_gpio (X4.27)
NetR8_1: audio (R8.1), spider-som (X2.139)
NetR9_1: audio (R9.1), spider-som (X2.140)
NetR10_1: audio (R10.1), spider-som (X2.141)
NetR11_1: audio (R11.1), spider-som (X2.142)
NetR59_1: wifi (R59.1), spider-som (X2.241)
NetR60_1: wifi (R60.1), spider-som (X2.243)
NetR61_1: audio (U2.1 Y1.3), spider-som (X2.165), expansion_gpio (R61.1)
NetRR1_1: wifi (RR1.1), spider-som (X2.237)
NetRR1_2: wifi (RR1.2), spider-som (X2.239)
NetRR1_3: wifi (RR1.3), spider-som (X2.231)
NetRR1_4: wifi (RR1.4), spider-som (X2.227)
NetU8_1: spider-som (X2.155), rs485 (U8.1)
NetU8_4: spider-som (X2.159), rs485 (U8.4)
NetU9_1: spider-som (X2.147), rs485 (U9.1)
NetU9_2: spider-som (X2.145), rs485 (U9.2 U9.3)
NetU9_4: spider-som (X2.151), rs485 (U9.4)
NetX2_78: spider-som (X2.78), expansion_gpio (X5.34)
NetX2_79: spider-som (X2.79), expansion_gpio (X3.9)
NetX2_80: spider-som (X2.80), expansion_gpio (X5.36)
NetX2_81: spider-som (X2.81), expansion_gpio (X3.7)
NetX2_82: spider-som (X2.82), expansion_gpio (X5.38)
NetX2_83: spider-som (X2.83), expansion_gpio (X3.13)
NetX2_84: spider-som (X2.84), expansion_gpio (X5.40)
NetX2_85: spider-som (X2.85), expansion_gpio (X3.15)
NetX2_87: spider-som (X2.87), expansion_gpio (X3.17)
NetX2_89: spider-som (X2.89), expansion_gpio (X3.6)
NetX2_91: spider-som (X2.91), expansion_gpio (X3.8)
NetX2_93: spider-som (X2.93), expansion_gpio (X3.5)
NetX2_95: spider-som (X2.95), expansion_gpio (X3.2)
NetX2_97: spider-som (X2.97), expansion_gpio (X3.3)
NetX2_99: spider-som (X2.99), expansion_gpio (X3.10)
NetX2_101: spider-som (X2.101), expansion_gpio (X3.4)
NetX2_103: spider-som (X2.103), expansion_gpio (X3.20)
NetX2_105: spider-som (X2.105), expansion_gpio (X3.19)
NetX2_131: spider-som (X2.131), expansion_gpio (X4.19)
NetX2_133: spider-som (X2.133), expansion_gpio (X4.23)
NetX2_135: spider-som (X2.135), expansion_gpio (X4.21)
NetX2_137: spider-som (X2.137), expansion_gpio (X4.24)
NetX2_149: spider-som (X2.149), expansion_gpio (X4.26)
NetX2_160: spider-som (X2.160), expansion_gpio (X5.33)
NetX2_162: spider-som (X2.162), expansion_gpio (X5.35)
NetX2_163: spider-som (X2.163), expansion_gpio (X4.12)
NetX2_166: spider-som (X2.166), expansion_gpio (X4.10)
NetX2_168: spider-som (X2.168), expansion_gpio (X4.8)
NetX2_169: spider-som (X2.169), expansion_gpio (X5.25)
NetX2_171: spider-som (X2.171), expansion_gpio (X5.4)
NetX2_173: spider-som (X2.173), expansion_gpio (X5.26)
NetX2_175: spider-som (X2.175), expansion_gpio (X5.28)
NetX2_177: spider-som (X2.177), expansion_gpio (X5.7)
NetX2_179: spider-som (X2.179), expansion_gpio (X5.8)
NetX2_181: spider-som (X2.181), expansion_gpio (X5.16)
NetX2_183: spider-som (X2.183), expansion_gpio (X5.1)
NetX2_185: spider-som (X2.185), expansion_gpio (X5.27)
NetX2_187: spider-som (X2.187), expansion_gpio (X5.14)
NetX2_189: spider-som (X2.189), expansion_gpio (X5.3)
NetX2_191: spider-som (X2.191), expansion_gpio (X5.13)
NetX2_193: spider-som (X2.193), expansion_gpio (X5.15)
NetX2_195: spider-som (X2.195), expansion_gpio (X5.12)
NetX2_197: spider-som (X2.197), expansion_gpio (X5.11)
NetX2_199: spider-som (X2.199), expansion_gpio (X5.2)
NetX2_201: spider-som (X2.201), expansion_gpio (X5.10)
NetX2_203: spider-som (X2.203), expansion_gpio (X5.9)
NetX2_205: spider-som (X2.205), expansion_gpio (X5.17)
NetX2_207: spider-som (X2.207), expansion_gpio (X5.18)
NetX2_209: spider-som (X2.209), expansion_gpio (X5.20)
NetX2_211: spider-som (X2.211), expansion_gpio (X5.6)
NetX2_213: spider-som (X2.213), expansion_gpio (X5.5)
NetX2_215: spider-som (X2.215), expansion_gpio (X5.19)
NetX2_217: spider-som (X2.217), expansion_gpio (X5.23)
NetX2_219: spider-som (X2.219), expansion_gpio (X5.22)
NetX2_221: spider-som (X2.221), expansion_gpio (X5.24)
NetX2_223: spider-som (X2.223), expansion_gpio (X5.21)
Relay1: spider-som (X2.143), relay (VT2.1)
Relay2: spider-som (X2.144), relay (VT2.2)
SYS_RESETn: audio (U2.31), boot (S2.3 S2.4)
TXDEN0: spider-som (X2.161), rs485 (U8.2 U8.3)
WLAN_EN: wifi (DD2.13), spider-som (X2.235)
WLAN_IRQ: wifi (DD2.12), spider-som (X2.233)